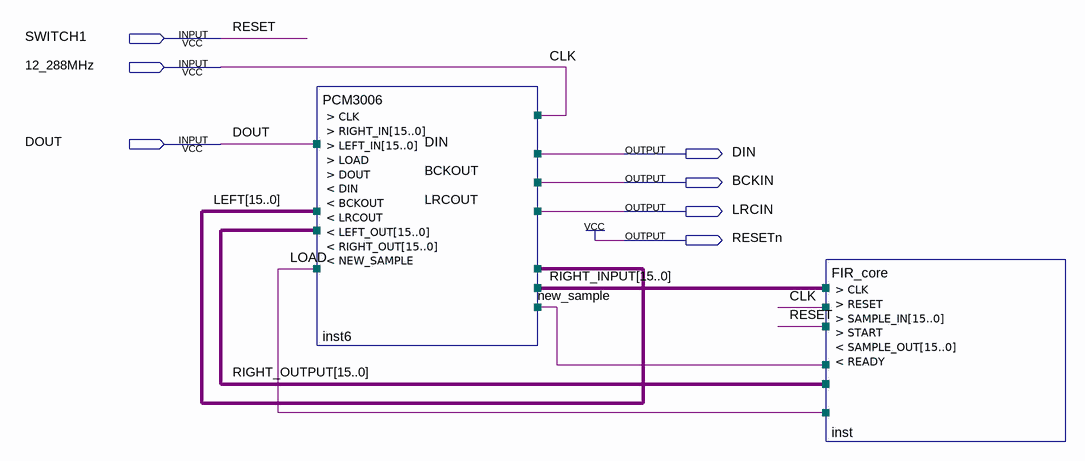
[diagram p0: schematic sheet]
// Quartus schematic ex11.bdf as structural Verilog: 2 symbols, 7 pins
module ex11 (
  input  SWITCH1,
  input  \12_288MHz ,
  input  DOUT,
  output DIN,
  output BCKIN,
  output LRCIN,
  output RESETn
);

  wire LOAD, new_sample;
  wire [15:0] LEFT, RIGHT_INPUT, RIGHT_OUTPUT;

  PCM3006 inst6 (
    .CLK(\12_288MHz ), .RIGHT_IN(RIGHT_OUTPUT), .LEFT_IN(LEFT), .LOAD(LOAD), .DOUT(DOUT), .DIN(DIN),
    .BCKOUT(BCKIN), .LRCOUT(LRCIN), .LEFT_OUT(RIGHT_INPUT), .RIGHT_OUT(LEFT), .NEW_SAMPLE(new_sample));
  FIR_core inst (
    .CLK(\12_288MHz ), .RESET(SWITCH1), .SAMPLE_IN(RIGHT_INPUT), .START(new_sample),
    .SAMPLE_OUT(RIGHT_OUTPUT), .READY(LOAD));

  assign RESETn = 1'b1;

  // Other names for the same wires on the sheet: BCKOUT = BCKIN; CLK = \12_288MHz ; LRCOUT = LRCIN; RESET = SWITCH1
endmodule
